# Altium schematic sheet sch_2022-04-21.schdoc
size 217 x 188 mm
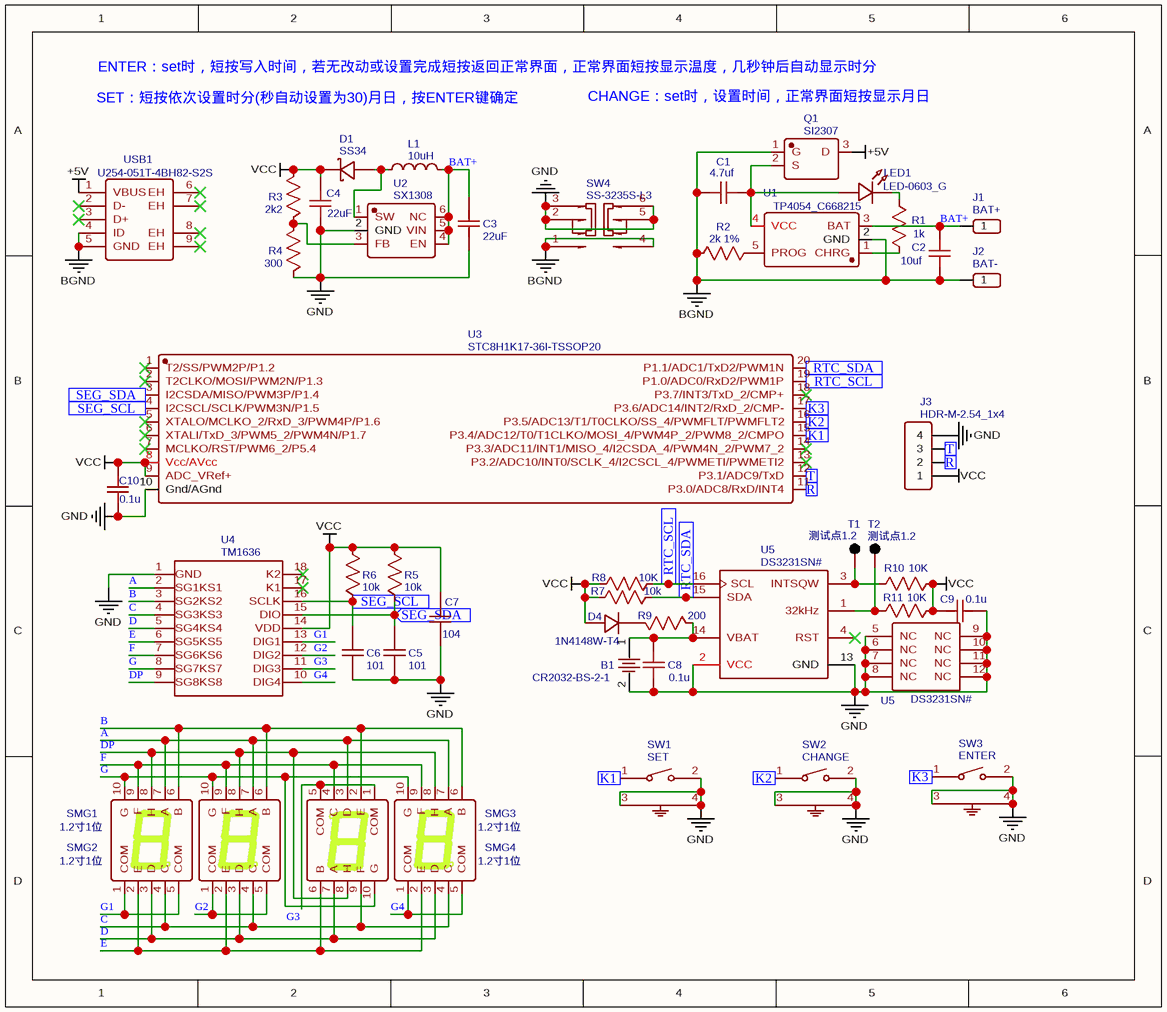
[diagram p0: sch_2022-04-21.schdoc]

## Parts
(Parts that share a designator on the sheet are numbered #1, #2 ... from top to bottom, then left to right.)
B1  CR2032-BS-2-1  [BAT-TH_BS-2-1]
C1  4.7uf  [C0805]
C2  10uf  [C0805]
C3  22uF  [C0805]
C4  22uF  [C0805]
C5  101  [C0603]
C6  101  [C0603]
C7  104  [C0805]
C8  0.1u  [C0805]
C9  0.1u  [C0805]
C10  0.1u  [C0805]
D1  SS34  [DO-214AC_L4.3-W2.7-LS5.3-RD]
D4  1N4148W-T4  [SOD-123_L2.8-W1.8-LS3.7-RD]
J1  BAT+  [HDR-M-2.54_1X1]
J2  BAT-  [HDR-M-2.54_1X1]
J3  HDR-M-2.54_1x4  [HDR-M-2.54_1X4]
L1  10uH  [IND-SMD_L5.0-W5.0]
LED1  LED-0603_G  [LED0603_GREEN]
Q1  SI2307  [SOT-23-3_L3.0-W1.7-P0.95-LS2.9-BR]
R1  1k  [R0603]
R2  2k 1%  [R0805]
R3  2k2  [R0805]
R4  300  [R0805]
R5  10k  [R0603]
R6  10k  [R0603]
R7  10k  [R0805]
R8  10K  [R0805]
R9  200  [R0805]
R10  10K  [R0805]
R11  10K  [R0805]
SMG1  1.2寸1位  [1.2寸数码管]
SMG2  1.2寸1位  [1.2寸数码管]
SMG3  1.2寸1位  [1.2寸数码管]
SMG4  1.2寸1位  [1.2寸数码管]
SW1  SET  [SW-TH_TC-1102N-C-QL-B]
SW2  CHANGE  [SW-TH_TC-1102N-C-QL-B]
SW3  ENTER  [SW-TH_TC-1102N-C-QL-B]
SW4  SS-3235S-L3  [SW-SMD_SS-3235S-L3.00]
T1  测试点1.2  [测试点]
T2  测试点1.2  [测试点]
U1  TP4054_C668215  [SOT-23-5_L3.0-W1.7-P0.95-LS2.8-BL]
U2  SX1308  [SOT-23-6_L2.9-W1.6-P0.95-LS2.8-BR]
U3  STC8H1K17-36I-TSSOP20  [TSSOP-20_L6.5-W4.4-P0.65-LS6.4-BL]
U4  TM1636  [DIP18-2.54-22.8X7.62MM]
U5#1  DS3231SN#  [SOIC-16_L10.3-W7.5-P1.27-LS10.3-BL]
U5#2  DS3231SN#  [SOIC-16_L10.3-W7.5-P1.27-LS10.3-BL]
USB1  U254-051T-4BH82-S2S  [MICRO-USB-SMD_U254-051T-4BH82-S2S]

## Ports
K1 (in), K2 (in), K3 (in), R (in), RTC_SCL (in), RTC_SDA (in), SEG_SCL (in), SEG_SDA (in), T (in)

## Nets
+5V: Q1.3(D) USB1.1(VBUS)
BGND: C1.1 C2.1 J2.1 Q1.1(G) R2.1 SW4.1 SW4.4 U1.2(GND) USB1.4(ID) USB1.5(GND)
GND: B1.2 C3.1 C4.1 C5.1 C6.2 C7.1 C8.1 C9.2 C10.1 J3.4 R4.2 SW1.2 SW1.3 SW1.4 SW2.2 SW2.3 SW2.4 SW3.2 SW3.3 SW3.4 SW4.2 SW4.3 SW4.5 SW4.6 U2.2(GND) U3.10(Gnd/AGnd) U4.1(GND) U5#1.2(VCC) U5#1.13(GND) U5#2.5(NC) U5#2.6(NC) U5#2.7(NC) U5#2.8(NC) U5#2.9(NC) U5#2.10(NC) U5#2.11(NC) U5#2.12(NC)
VCC: C4.2 C7.2 C9.1 C10.2 D1.1(K) D4.2(A) J3.1 R3.2 R5.2 R6.2 R7.1 R8.2 R10.1 R11.1 U3.8(Vcc/AVcc) U3.9(ADC_VRef+) U4.14(VDD)
A: SMG1.7(A) SMG2.7(A) SMG3.3(D) SMG4.7(A) U4.2(SG1KS1)
B: SMG1.6(B) SMG2.6(B) SMG3.2(E) SMG4.6(B) U4.3(SG2KS2)
BAT+: C2.2 C3.2 J1.1 L1.2 U1.3(BAT) U2.4(EN) U2.5(VIN) U2.6(NC)
C: SMG1.4(C) SMG2.4(C) SMG3.9(F) SMG4.4(C) U4.4(SG3KS3)
D: SMG1.3(D) SMG2.3(D) SMG3.7(A) SMG4.3(D) U4.5(SG4KS4)
DP: SMG1.8(H) SMG2.8(H) SMG3.8(H) SMG4.8(H) U4.9(SG8KS8)
E: SMG1.2(E) SMG2.2(E) SMG3.6(B) SMG4.2(E) U4.6(SG5KS5)
F: SMG1.9(F) SMG2.9(F) SMG3.4(C) SMG4.9(F) U4.7(SG6KS6)
G: SMG1.10(G) SMG2.10(G) SMG3.10(G) SMG4.10(G) U4.8(SG7KS7)
G1: SMG1.1(COM) SMG1.5(COM) U4.13(DIG1)
G2: SMG2.1(COM) SMG2.5(COM) U4.12(DIG2)
G3: SMG3.1(COM) SMG3.5(COM) U4.11(DIG3)
G4: SMG4.1(COM) SMG4.5(COM) U4.10(DIG4)
K1: SW1.1 U3.15(P3.4/ADC12/T0/T1CLKO/MOSI_4/PWM4P_2/PWM8_2/CMPO) ; port K1
K2: SW2.1 U3.16(P3.5/ADC13/T1/T0CLKO/SS_4/PWMFLT/PWMFLT2) ; port K2
K3: SW3.1 U3.17(P3.6/ADC14/INT2/RxD_2/CMP-) ; port K3
R: J3.2 U3.11(P3.0/ADC8/RxD/INT4) ; port R
RTC_SCL: R8.1 U3.19(P1.0/ADC0/RxD2/PWM1P) U5#1.16(SCL) ; port RTC_SCL
RTC_SDA: R7.2 U3.20(P1.1/ADC1/TxD2/PWM1N) U5#1.15(SDA) ; port RTC_SDA
SEG_SCL: C6.1 R6.1 U3.4(I2CSCL/SCLK/PWM3N/P1.5) U4.16(SCLK) ; port SEG_SCL
SEG_SDA: C5.2 R5.1 U3.3(I2CSDA/MISO/PWM3P/P1.4) U4.15(DIO) ; port SEG_SDA
T: J3.3 U3.12(P3.1/ADC9/TxD) ; port T
NetB1_1: B1.1 C8.2 R9.1 U5#1.14(VBAT)
NetC1_2: C1.2 LED1.1 Q1.2(S) U1.4(VCC)
NetD1_2: D1.2(A) L1.1 U2.1(SW)
NetD4_1: D4.1(C) R9.2
NetLED1_2: LED1.2 R1.2
NetR1_1: R1.1 U1.1(CHRG)
NetR2_2: R2.2 U1.5(PROG)
NetR3_1: R3.1 R4.1 U2.3(FB)
NetR10_2: R10.2 T1.1 U5#1.3(INTSQW)
NetR11_2: R11.2 T2.1 U5#1.1(32kHz)

Not connected (* = marked no-connect by the designer): U3 1(T2/SS/PWM2P/P1.2)* 2(T2CLKO/MOSI/PWM2N/P1.3)* 5(XTALO/MCLKO_2/RxD_3/PWM4P/P1.6)* 6(XTALI/TxD_3/PWM5_2/PWM4N/P1.7)* 7(MCLKO/RST/PWM6_2/P5.4)* 13(P3.2/ADC10/INT0/SCLK_4/I2CSCL_4/PWMETI/PWMETI2)* 14(P3.3/ADC11/INT1/MISO_4/I2CSDA_4/PWM4N_2/PWM7_2)* 18(P3.7/INT3/TxD_2/CMP+)*; U4 17(K1)* 18(K2)*; U5#1 4(RST)*; USB1 2(D-)* 3(D+)* 6(EH)* 7(EH)* 8(EH)* 9(EH)*

## Notes on the sheet
- ENTER：set时，短按写入时间，若无改动或设置完成短按返回正常界面，正常界面短按显示温度，几秒钟后自动显示时分
- SET：短按依次设置时分(秒自动设置为30)月日，按ENTER键确定
- (near Q1) CHANGE：set时，设置时间，正常界面短按显示月日

## Library data of the parts
B1 = CR2032-BS-2-1: BOM_Manufacturer: Q&J; BOM_Manufacturer Part: BS-2-1; BOM_Supplier: LCSC; BOM_Supplier Part: C70376; BOM_JLCPCB Part Class: Extended Part; spicePre: B; spiceSymbolName: CR2032-BS-2-1
C1 = 4.7uf: nameAlias: Value(F); Contributor: LCEDA_Lib; spicePre: C; spiceSymbolName: C_0805_US
C2 = 10uf: nameAlias: Value(F); Contributor: LCEDA_Lib; spicePre: C; spiceSymbolName: C_0805_US
C3 C4 = 22uF: BOM_Manufacturer: Samsung Electro-Mechanics; BOM_Manufacturer Part: CL21A226MAYNNNE; nameAlias: Capacitance; Contributor: LCSC; BOM_Supplier: LCSC; BOM_Supplier Part: C602037; BOM_JLCPCB Part Class: Extended Part; spicePre: C; spiceSymbolName: CL21A226MAYNNNE
C5 C6 = 101: nameAlias: Value(F); Contributor: LCEDA_Lib; spicePre: C; spiceSymbolName: C_0603_US
C7 = 104: nameAlias: Value(F); Contributor: LCEDA_Lib; spicePre: C; spiceSymbolName: C_0805_US
C8-C10 = 0.1u: nameAlias: Value(F); Contributor: LCEDA_Lib; spicePre: C; spiceSymbolName: C_0805_US
D1 = SS34: BOM_Manufacturer: MDD; BOM_Supplier: LCSC; BOM_Manufacturer Part: SS34; BOM_Supplier Part: C8678; BOM_JLCPCB Part Class: Basic Part; spicePre: D; spiceSymbolName: SS34_C8678
D4 = 1N4148W-T4: BOM_Manufacturer: Guangdong Hottech; Contributor: LCSC; BOM_Supplier: LCSC; BOM_Supplier Part: C181134; BOM_Manufacturer Part: 1N4148W-T4; BOM_JLCPCB Part Class: Extended Part; spicePre: D; spiceSymbolName: 1N4148W-T4
J1 = BAT+: Contributor: LCEDA_Lib; BOM_Supplier Part: C81276; BOM_Supplier: LCSC; spicePre: J; spiceSymbolName: HDR-M-2.54_1x1
J2 = BAT-: Contributor: LCEDA_Lib; BOM_Supplier Part: C81276; BOM_Supplier: LCSC; spicePre: J; spiceSymbolName: HDR-M-2.54_1x1
J3 = HDR-M-2.54_1x4: Contributor: LCEDA_Lib; BOM_Supplier Part: C124378; BOM_Supplier: LCSC; spicePre: J; spiceSymbolName: HDR-M-2.54_1x4
L1 = 10uH: BOM_Manufacturer: PROD Tech; BOM_Manufacturer Part: PSPNAQ5040-100M; nameAlias: Inductance; Contributor: LCSC; BOM_Supplier: LCSC; BOM_Supplier Part: C436710; BOM_JLCPCB Part Class: Extended Part; spicePre: L; spiceSymbolName: PSPNAQ5040-100M
LED1 = LED-0603_G: BOM_Manufacturer: EVERLIGHT(台湾亿光); BOM_Manufacturer Part: 19-217/GHC-YR1S2/3T; Contributor: LCEDA_Lib; BOM_Supplier Part: C72043; BOM_Supplier: LCSC; spicePre: L; spiceSymbolName: LED-0603_G
Q1 = SI2307: BOM_Manufacturer: Guangdong Hottech; Contributor: LCSC; BOM_Supplier: LCSC; BOM_Supplier Part: C189813; BOM_Manufacturer Part: SI2307; BOM_JLCPCB Part Class: Extended Part; spicePre: Q; spiceSymbolName: SI2307
R1 = 1k: nameAlias: Value(Ω); Contributor: LCEDA_Lib; spicePre: R; spiceSymbolName: R_0603_US
R2 = 2k 1%: nameAlias: Value(Ω); Contributor: LCEDA_Lib; spicePre: R; spiceSymbolName: R_0805_US
R3 = 2k2: nameAlias: Value(Ω); Contributor: LCEDA_Lib; spicePre: R; spiceSymbolName: R_0805_US
R4 = 300: nameAlias: Value(Ω); Contributor: LCEDA_Lib; spicePre: R; spiceSymbolName: R_0805_US
R5-R7 = 10k: nameAlias: Value(Ω); Contributor: LCEDA_Lib; spicePre: R
  R5 R6: spiceSymbolName: R_0603_US
  R7: spiceSymbolName: R_0805_US
R8 R10 R11 = 10K: nameAlias: Value(Ω); Contributor: LCEDA_Lib; spicePre: R; spiceSymbolName: R_0805_US
R9 = 200: nameAlias: Value(Ω); Contributor: LCEDA_Lib; spicePre: R; spiceSymbolName: R_0805_US
SMG1-SMG4 = 1.2寸1位: Contributor: gefyyg; spicePre: S; spiceSymbolName: 1.2寸1位-10
SW1 = SET: BOM_Manufacturer: XKB Enterprise; BOM_Manufacturer Part: TC-1102N-C-QL-B; Contributor: LCSC; BOM_Supplier: LCSC; BOM_Supplier Part: C406155; BOM_JLCPCB Part Class: Extended Part; spicePre: S; spiceSymbolName: TC-1102N-C-QL-B
SW2 = CHANGE: BOM_Manufacturer: XKB Enterprise; BOM_Manufacturer Part: TC-1102N-C-QL-B; Contributor: LCSC; BOM_Supplier: LCSC; BOM_Supplier Part: C406155; BOM_JLCPCB Part Class: Extended Part; spicePre: S; spiceSymbolName: TC-1102N-C-QL-B
SW3 = ENTER: BOM_Manufacturer: XKB Enterprise; BOM_Manufacturer Part: TC-1102N-C-QL-B; Contributor: LCSC; BOM_Supplier: LCSC; BOM_Supplier Part: C406155; BOM_JLCPCB Part Class: Extended Part; spicePre: S; spiceSymbolName: TC-1102N-C-QL-B
SW4 = SS-3235S-L3: BOM_Manufacturer: XKB Enterprise; Contributor: LCSC; BOM_Supplier: LCSC; BOM_Supplier Part: C381098; BOM_Manufacturer Part: SS-3235S-L3; BOM_JLCPCB Part Class: Extended Part; spicePre: S; spiceSymbolName: SS-3235S-L3
T1 T2 = 测试点1.2: subpart_no: 1; Contributor: Wang233_CN; BOM_Supplier Part: undefined; spicePre: T; spiceSymbolName: 测试点1.2
U1 = TP4054_C668215: BOM_Manufacturer: UMW(Youtai Semiconductor Co., Ltd.); BOM_Manufacturer Part: TP4054; Contributor: LCSC; BOM_Supplier: LCSC; BOM_Supplier Part: C668215; BOM_JLCPCB Part Class: Extended Part; spicePre: U; spiceSymbolName: TP4054_C668215
U2 = SX1308: BOM_Manufacturer: SX; sourceId: g4Yg9rJ1j; timeStamp: 1472247539; BOM_Supplier: LCSC; BOM_Manufacturer Part: SX1308; BOM_Supplier Part: C78162; BOM_JLCPCB Part Class: Extended Part; spicePre: U; spiceSymbolName: SX1308
U3 = STC8H1K17-36I-TSSOP20: BOM_Manufacturer: STC Micro; Contributor: LCSC; BOM_Supplier: LCSC; BOM_Supplier Part: C915675; BOM_Manufacturer Part: STC8H1K17-36I-TSSOP20; BOM_JLCPCB Part Class: Extended Part; spicePre: U; spiceSymbolName: STC8H1K17-36I-TSSOP20
U4 = TM1636: description: DIP IC Driver;; sourceId: EwIigPpnz; timeStamp: 1448004853; BOM_Manufacturer Part: TM1636; spicePre: U; spiceSymbolName: TM1636
U5#1 U5#2 = DS3231SN#: BOM_Manufacturer: MAXIM; subpart_no: 1; tags: Clock; BOM_Supplier Part: C9866; BOM_Supplier: LCSC; BOM_Manufacturer Part: DS3231SN; image: http://image.lceda.cn/szlcsc/C9866.jpg; BOM_JLCPCB Part Class: Extended Part; spicePre: U; spiceSymbolName: DS3231SN#
USB1 = U254-051T-4BH82-S2S: BOM_Manufacturer: XKB Connectivity(中国星坤); Contributor: LCSC; BOM_Supplier: LCSC; BOM_Supplier Part: C908456; BOM_Manufacturer Part: U254-051T-4BH82-S2S; BOM_JLCPCB Part Class: Extended Part; spicePre: U; spiceSymbolName: U254-051T-4BH82-S2S